# Altium project Mach_nap_HEALA.PrjPcb
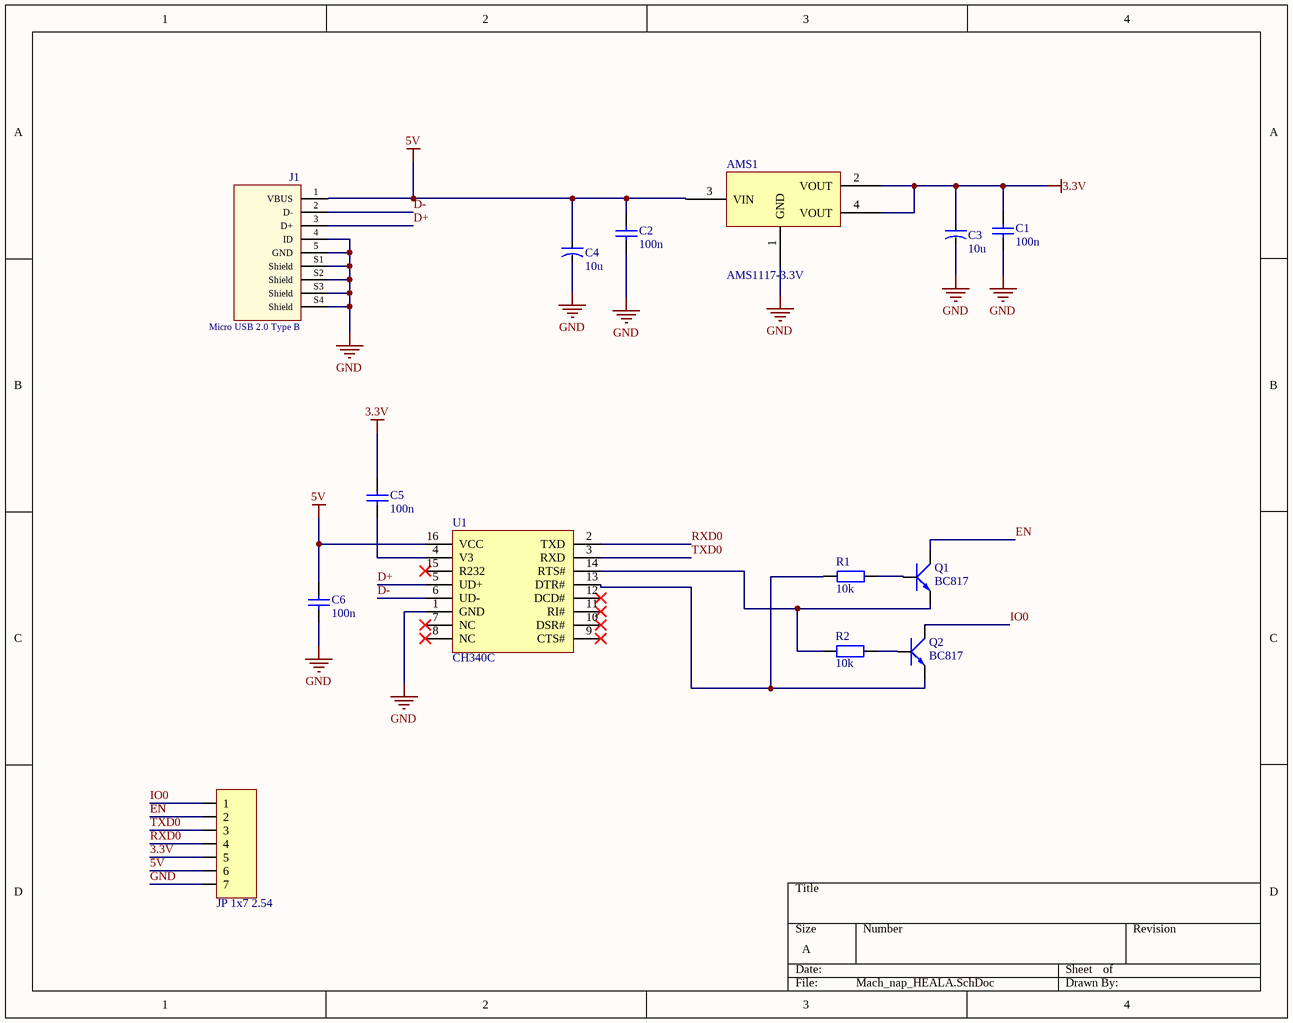
[diagram p0: Mach_nap_HEALA.SchDoc]
1 sheet, 14 parts. Net scope: global (net labels, ports and power ports of the same name join across sheets).
Board file: Mach_nap_HEALA.PcbDoc

## Sheet Mach_nap_HEALA.SchDoc
size A; SheetNumber: 1; SheetTotal: 1

### Parts
AMS1  AMS1117-3.3V  [SOT223]
C1  100n  [tu 1206]
C2  100n  [tu 1206]
C3  10u  [CAP-ALU-SMD-5x5.5x1.4]
C4  10u  [CAP-ALU-SMD-5x5.5x1.4]
C5  100n  [tu 1206]
C6  100n  [tu 1206]
J1  Micro USB 2.0 Type B  [629105136821]
JP1  JP 1x7 2.54  [JP 1x7 DT]
Q1  BC817  [SOT-23]
Q2  BC817  [SOT-23]
R1  10k  [tro smd 1206]
R2  10k  [tro smd 1206]
U1  CH340C  [SOIC16_50_284_25X90_SMT]

### Nets
3.3V: AMS1.2(VOUT) AMS1.4(VOUT) C1.1 C3.1 C5.1 JP1.5
5V: AMS1.3(VIN) C2.1 C4.1 C6.1 J1.1(VBUS) JP1.6 U1.16(VCC)
GND: AMS1.1(GND) C1.2 C2.2 C3.2 C4.2 C6.2 J1.4(ID) J1.5(GND) J1.S1(Shield) J1.S2(Shield) J1.S3(Shield) J1.S4(Shield) JP1.7 U1.1(GND)
D+: J1.3(D+) U1.5(UD+)
D-: J1.2(D-) U1.6(UD-)
EN: JP1.2 Q1.3(C)
IO0: JP1.1 Q2.3(C)
RXD0: JP1.4 U1.2(TXD)
TXD0: JP1.3 U1.3(RXD)
NetC5_2: C5.2 U1.4(V3)
NetQ1_1: Q1.1(B) R1.2
NetQ1_2: Q1.2(E) R2.1 U1.14(RTS#)
NetQ2_1: Q2.1(B) R2.2
NetQ2_2: Q2.2(E) R1.1 U1.13(DTR#)

Not connected (* = marked no-connect by the designer): U1 7(NC)* 8(NC)* 9(CTS#)* 10(DSR#)* 11(RI#)* 12(DCD#)* 15(R232)*

### Library data of the parts
AMS1 = AMS1117 SMD: Dán; Value: AMS1117-3.3V SOT223; Don_Vi: Con; Ma_Hang: MH000596; Ghi_Chu: *; Kieu_Chan: *; Chung_Loai: Dán
C1 C2 C5 C6 = Tu 1206 106 16V 20%: Dán; Don_Vi: Con; So_Chan: 2; Ten_Linh_Kien: Tụ 1206 106-10uF 20% 16V; Ma_Hang: MH004541; Chung_Loai: Dán; Kieu_Chan: *
C3 C4 = CN-SMD: Polarized Capacitor (Axial); Published: 8-Jun-2000; LatestRevisionDate: 17-Jul-2002; LatestRevisionNote: Re-released for DXP Platform.; PackageReference: POLAR0.8; Publisher: Altium Limited
J1 = 629105136821: Micro USB 2.0 Type B Horizontal SMT 5 Contacts WR-COM; Rated Current: 1 A; Gender: Female; ComponentLink1Description: Manufacturer; ComponentLink1URL: http://www.we-online.de; ComponentLink2Description: Datasheet; ComponentLink2URL: http://katalog.we-online.de/em/datasheet/629105136821.pdf; Part Number: 629105136821; Published Date: May 2018; Publisher: Wurth Elektronik; Orientation: Horizontal; Interface Type: Micro USB 2.0 Type B; Operating Temperature: -40 to 85 degC; Mounting Technology: SMT; Packaging: Tape and Reel
JP1 = JP 1x7 2.54 Duc Thang: Cắm; Ten_Linh_Kien: Jump Đơn Đực 2.54MM 1x40P Thẳng 11MM; Don_Vi: Con; Ma_Hang: MH000903; Ghi_Chu: *; Kieu_Chan: *; Chung_Loai: Cắm
Q1 Q2 = Trans BC817: SOT-23 - C8658; Value: C9014
R1 R2 = Tro 1206 5% 10k: Dán; Don_Vi: Con; So_Chan: 2; Ten_Linh_Kien: Trở 1206 5% 10K; Ma_Hang: MH005909; Chung_Loai: Dán; Kieu_Chan: *
U1 = CH340C: USB Bridge, USB to UART USB 2.0 UART Interface; Manufacturer: Olimex; Alternate Part Number-1: NA; Manufacturer Part Number: CH340C; Case/Package: SOIC16; Supplier-1: LCSC; Supplier Part Number-1: C84681